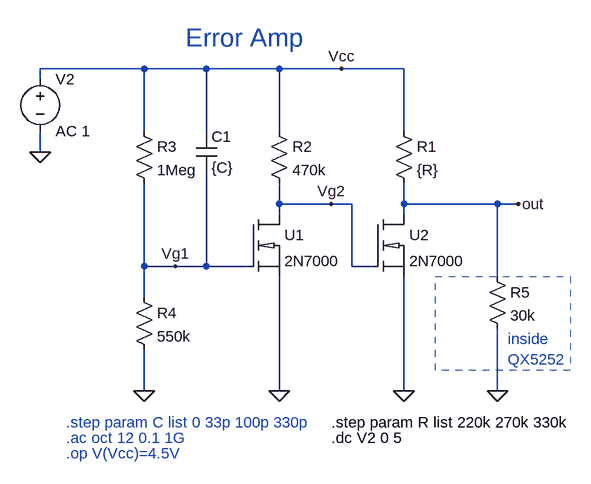
[diagram p0: schematic ErrorAmpACDC.asc]
ErrorAmpACDC.asc, the LTspice schematic file:
Version 4
SHEET 1 880 800
WIRE -880 128 -1040 128
WIRE -784 128 -880 128
WIRE -672 128 -784 128
WIRE -576 128 -672 128
WIRE -480 128 -576 128
WIRE -1040 144 -1040 128
WIRE -880 224 -880 128
WIRE -784 224 -784 128
WIRE -672 224 -672 128
WIRE -480 224 -480 128
WIRE -1040 256 -1040 224
WIRE -672 336 -672 304
WIRE -592 336 -672 336
WIRE -560 336 -592 336
WIRE -480 336 -480 304
WIRE -336 336 -480 336
WIRE -304 336 -336 336
WIRE -672 352 -672 336
WIRE -480 352 -480 336
WIRE -880 432 -880 304
WIRE -832 432 -880 432
WIRE -784 432 -784 288
WIRE -784 432 -832 432
WIRE -720 432 -784 432
WIRE -560 432 -560 336
WIRE -528 432 -560 432
WIRE -336 448 -336 336
WIRE -880 480 -880 432
WIRE -880 624 -880 560
WIRE -672 624 -672 448
WIRE -480 624 -480 448
WIRE -336 624 -336 528
FLAG -480 624 0
FLAG -672 624 0
FLAG -880 624 0
FLAG -576 128 Vcc
FLAG -832 432 Vg1
FLAG -592 336 Vg2
FLAG -304 336 out
FLAG -1040 256 0
FLAG -336 624 0
SYMBOL res -496 208 R0
SYMATTR InstName R1
SYMATTR Value {R}
SYMBOL res -688 208 R0
SYMATTR InstName R2
SYMATTR Value 470k
SYMBOL res -896 208 R0
SYMATTR InstName R3
SYMATTR Value 1Meg
SYMBOL res -896 464 R0
SYMATTR InstName R4
SYMATTR Value 550k
SYMBOL 2N7000 -720 352 R0
SYMATTR InstName U1
SYMBOL 2N7000 -528 352 R0
SYMATTR InstName U2
SYMBOL cap -800 224 R0
SYMATTR InstName C1
SYMATTR Value {C}
SYMBOL voltage -1040 128 R0
WINDOW 123 0 0 Left 0
WINDOW 39 0 0 Left 0
SYMATTR InstName V2
SYMATTR Value AC 1
SYMBOL res -352 432 R0
SYMATTR InstName R5
SYMATTR Value 30k
TEXT -816 80 Left 4 ;Error Amp
TEXT -1000 696 Left 2 ;.ac oct 12 0.1 1G
TEXT -1000 720 Left 2 ;.op V(Vcc)=4.5V
TEXT -1000 672 Left 2 ;.step param C list 0 33p 100p 330p
TEXT -592 696 Left 2 !.dc V2 0 5
TEXT -592 672 Left 2 !.step param R list 220k 270k 330k
TEXT -320 544 Left 2 ;inside\nQX5252
RECTANGLE Normal -224 592 -432 448 2

The netlist it stands for:
* ErrorAmpACDC.asc
R1 Vcc out {R}
R2 Vcc Vg2 470k
R3 Vcc Vg1 1Meg
R4 Vg1 0 550k
XU1 Vg2 Vg1 0 2N7000  ; pins D G S
XU2 out Vg2 0 2N7000  ; pins D G S
C1 Vcc Vg1 {C}
V2 Vcc 0 AC 1
R5 out 0 30k
* Error Amp
* .ac oct 12 0.1 1G
* .op V(Vcc)=4.5V
* .step param C list 0 33p 100p 330p
.dc V2 0 5
.step param R list 220k 270k 330k
* inside
* QX5252
.lib 2N7000.lib
.backanno
.end